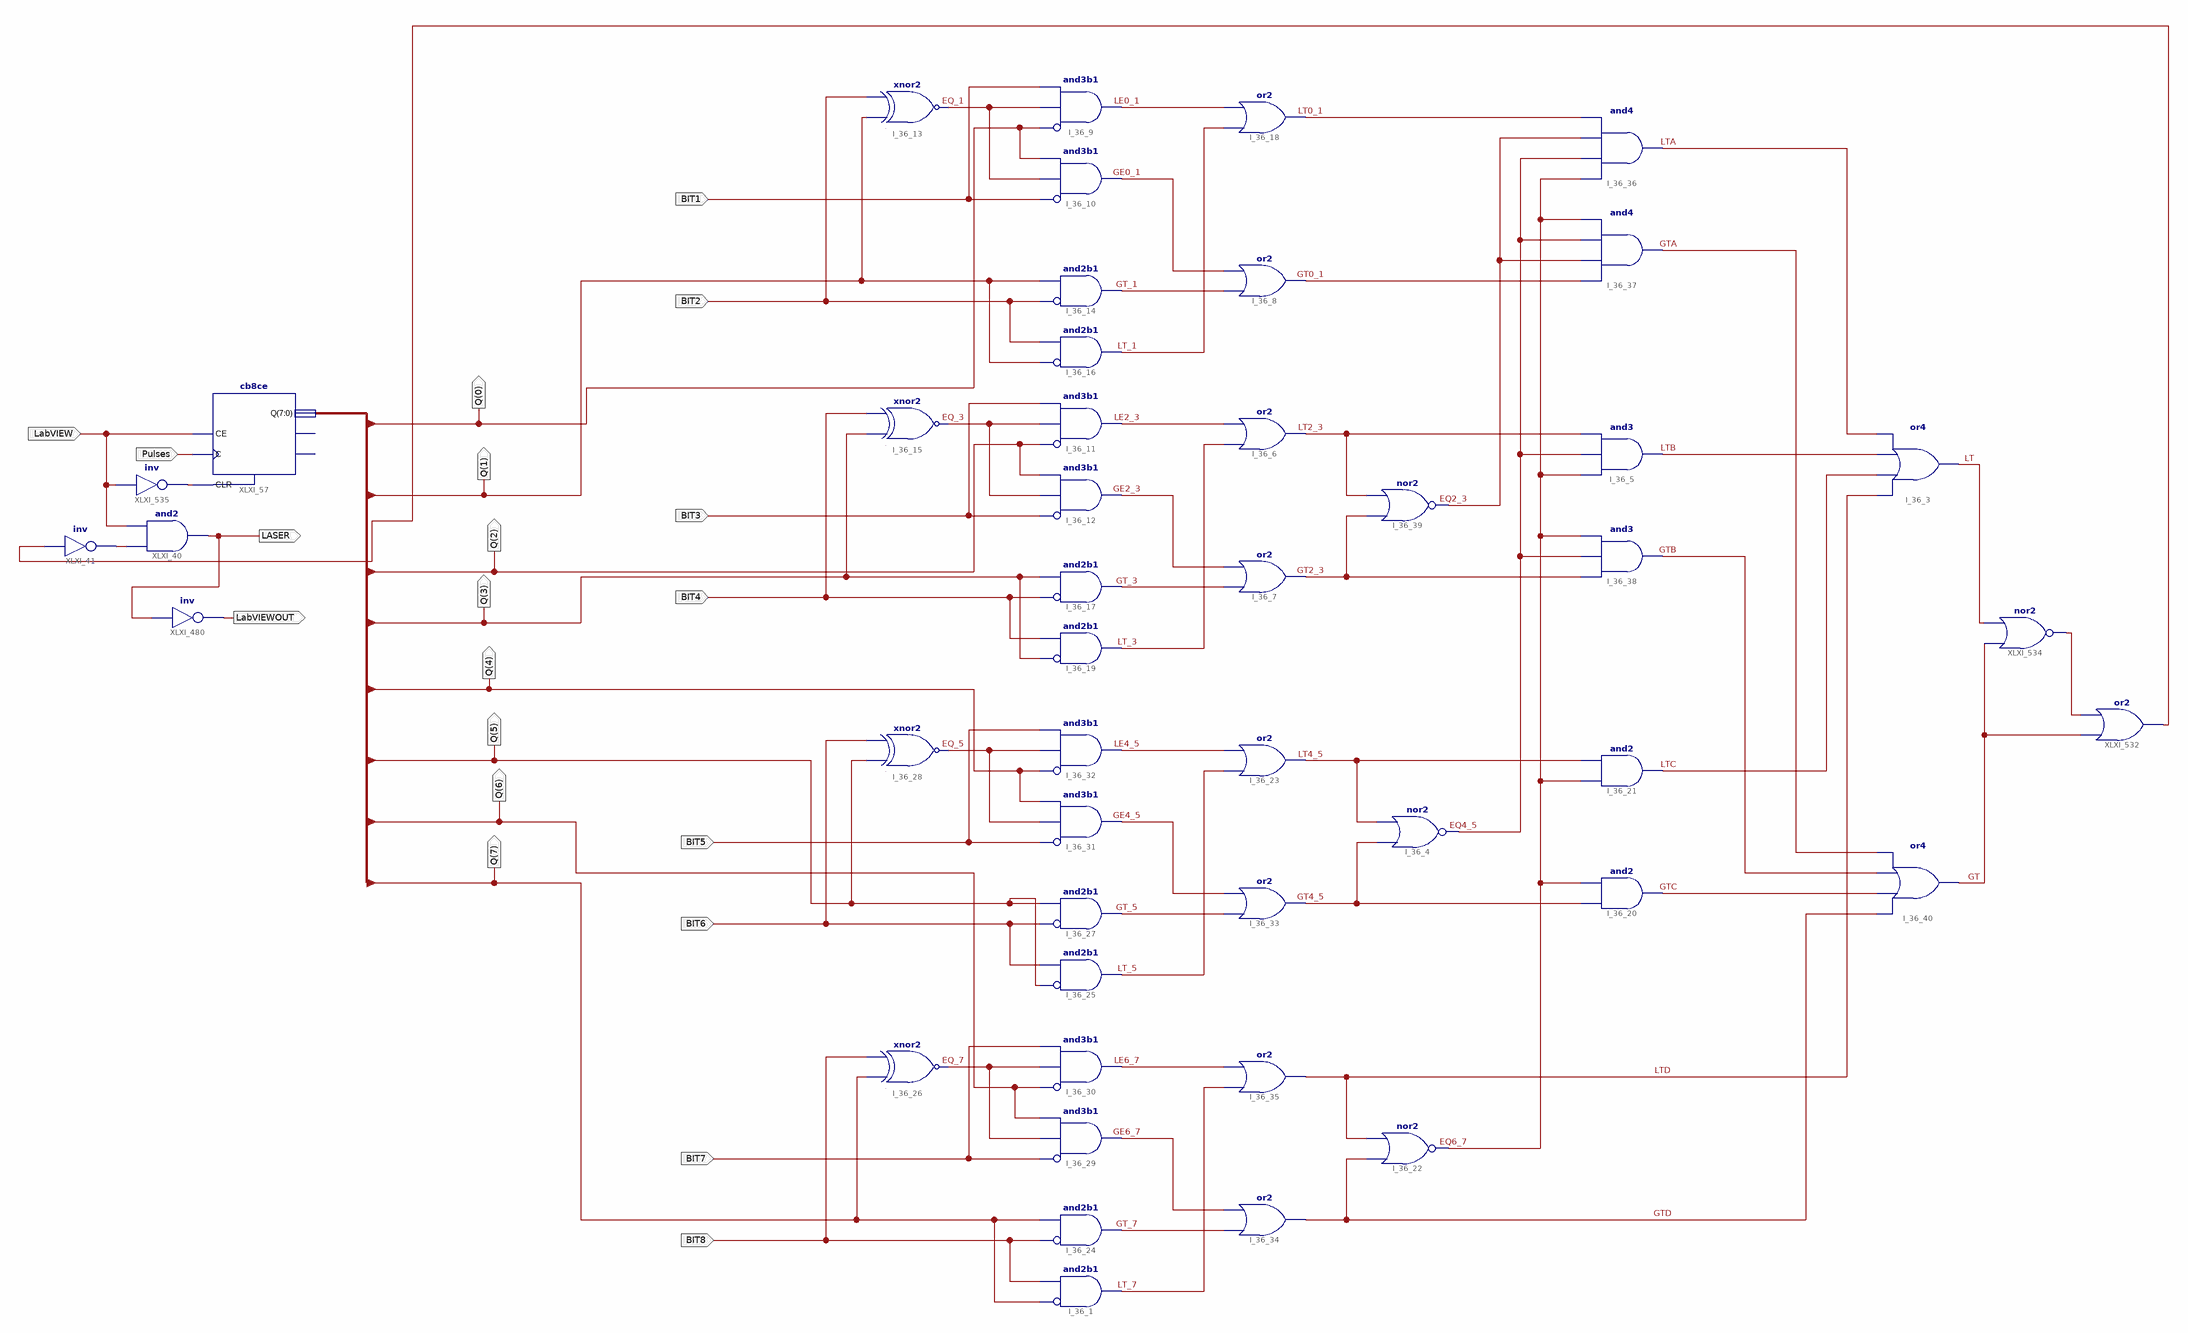
[diagram p0: schematic sheet 1]
// Xilinx ISE schematic visionFPGAschematic.sch (spartan3) as structural Verilog: 46 symbols, 20 ports
module visionFPGAschematic (
  input  Pulses,
  input  LabVIEW,
  input  BIT1,
  input  BIT2,
  input  BIT3,
  input  BIT4,
  input  BIT5,
  input  BIT6,
  input  BIT8,
  input  BIT7,
  output LASER,
  output [7:0] Q,
  output LabVIEWOUT
);

  wire EQ2_3, EQ4_5, EQ6_7, EQ_1, EQ_3, EQ_5, EQ_7, GE0_1, GE2_3, GE4_5, GE6_7, GT, GT0_1, GT2_3, GT4_5,
       GT_1, GT_3, GT_5, GT_7, GTA, GTB, GTC, GTD, LASEROFF, LE0_1, LE2_3, LE4_5, LE6_7, LT, LT0_1, LT2_3,
       LT4_5, LT_1, LT_3, LT_5, LT_7, LTA, LTB, LTC, LTD, XLXN_72, XLXN_898, XLXN_902;

  and I_36_37 (GTA, GT0_1, EQ2_3, EQ4_5, EQ6_7);
  and I_36_36 (LTA, EQ6_7, EQ4_5, EQ2_3, LT0_1);
  and I_36_21 (LTC, EQ6_7, LT4_5);
  and I_36_20 (GTC, GT4_5, EQ6_7);
  xnor I_36_28 (EQ_5, Q[5], BIT6);
  xnor I_36_26 (EQ_7, Q[7], BIT8);
  xnor I_36_15 (EQ_3, Q[3], BIT4);
  xnor I_36_13 (EQ_1, Q[1], BIT2);
  and I_36_32 (LE4_5, ~Q[4], EQ_5, BIT5);  // and3b1
  and I_36_31 (GE4_5, ~BIT5, EQ_5, Q[4]);  // and3b1
  and I_36_30 (LE6_7, ~Q[6], EQ_7, BIT7);  // and3b1
  and I_36_29 (GE6_7, ~BIT7, EQ_7, Q[6]);  // and3b1
  and I_36_12 (GE2_3, ~BIT3, EQ_3, Q[2]);  // and3b1
  and I_36_11 (LE2_3, ~Q[2], EQ_3, BIT3);  // and3b1
  and I_36_10 (GE0_1, ~BIT1, EQ_1, Q[0]);  // and3b1
  and I_36_9 (LE0_1, ~Q[0], EQ_1, BIT1);  // and3b1
  or I_36_35 (LTD, LT_7, LE6_7);
  or I_36_34 (GTD, GT_7, GE6_7);
  or I_36_33 (GT4_5, GT_5, GE4_5);
  or I_36_23 (LT4_5, LT_5, LE4_5);
  or I_36_18 (LT0_1, LT_1, LE0_1);
  or I_36_8 (GT0_1, GT_1, GE0_1);
  or I_36_7 (GT2_3, GT_3, GE2_3);
  or I_36_6 (LT2_3, LT_3, LE2_3);
  and I_36_38 (GTB, GT2_3, EQ4_5, EQ6_7);
  and I_36_5 (LTB, EQ6_7, EQ4_5, LT2_3);
  nor I_36_39 (EQ2_3, GT2_3, LT2_3);
  nor I_36_22 (EQ6_7, GTD, LTD);
  nor I_36_4 (EQ4_5, GT4_5, LT4_5);
  or I_36_40 (GT, GTD, GTC, GTB, GTA);
  or I_36_3 (LT, LTD, LTC, LTB, LTA);
  and I_36_27 (GT_5, ~BIT6, Q[5]);  // and2b1
  and I_36_25 (LT_5, ~Q[5], BIT6);  // and2b1
  and I_36_24 (GT_7, ~BIT8, Q[7]);  // and2b1
  and I_36_19 (LT_3, ~Q[3], BIT4);  // and2b1
  and I_36_17 (GT_3, ~BIT4, Q[3]);  // and2b1
  and I_36_16 (LT_1, ~Q[1], BIT2);  // and2b1
  and I_36_14 (GT_1, ~BIT2, Q[1]);  // and2b1
  and I_36_1 (LT_7, ~Q[7], BIT8);  // and2b1
  and XLXI_40 (LASER, XLXN_72, LabVIEW);
  not XLXI_41 (XLXN_72, LASEROFF);
  cb8ce XLXI_57 (.C(Pulses), .CE(LabVIEW), .CLR(XLXN_902), .Q(Q));  // open: CEO, TC
  not XLXI_480 (LabVIEWOUT, LASER);
  or XLXI_532 (LASEROFF, GT, XLXN_898);
  nor XLXI_534 (XLXN_898, GT, LT);
  not XLXI_535 (XLXN_902, LabVIEW);
endmodule
